# Altium schematic sheet sensor.SchDoc
size A3
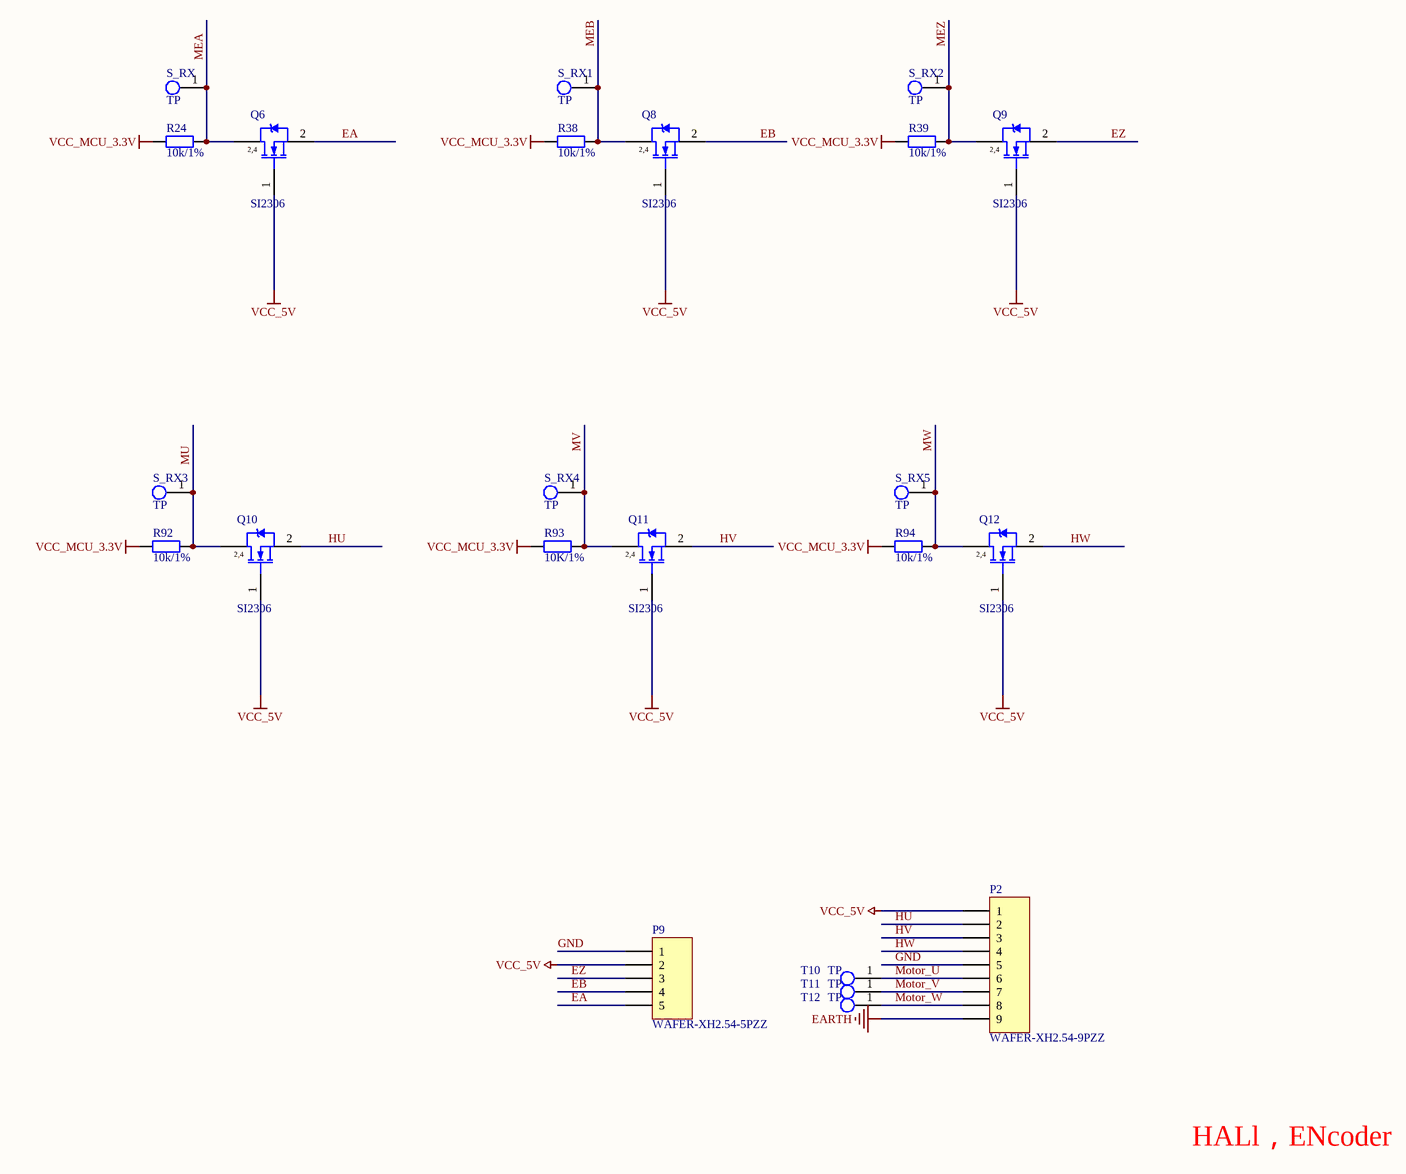
[diagram p0: sensor.SchDoc]

## Parts
P2  WAFER-XH2.54-9PZZ  [XA2.5-9P]
P9  WAFER-XH2.54-5PZZ  [XA2.5-5P]
Q6  SI2306  [SOT23-3]
Q8  SI2306  [SOT23-3]
Q9  SI2306  [SOT23-3]
Q10  SI2306  [SOT23-3]
Q11  SI2306  [SOT23-3]
Q12  SI2306  [SOT23-3]
R24  10k/1%  [0603R]
R38  10k/1%  [0603R]
R39  10k/1%  [0603R]
R92  10k/1%  [0603R]
R93  10K/1%  [0603R]
R94  10k/1%  [0603R]
S_RX  TP  [TPD]
S_RX1  TP  [TPD]
S_RX2  TP  [TPD]
S_RX3  TP  [TPD]
S_RX4  TP  [TPD]
S_RX5  TP  [TPD]
T10  TP  [TPD]
T11  TP  [TPD]
T12  TP  [TPD]

## Nets
EARTH: P2.9
VCC_5V: P2.1 P9.2 Q6.1(G) Q8.1(G) Q9.1(G) Q10.1(G) Q11.1(G) Q12.1(G)
VCC_MCU_3.3V: R24.1 R38.1 R39.1 R92.1 R93.1 R94.1
EA: P9.5 Q6.2(S)
EB: P9.4 Q8.2(S)
EZ: P9.3 Q9.2(S)
GND: P2.5 P9.1
HU: P2.2 Q10.2(S)
HV: P2.3 Q11.2(S)
HW: P2.4 Q12.2(S)
MEA: Q6.3(D) R24.2 S_RX.1
MEB: Q8.3(D) R38.2 S_RX1.1
MEZ: Q9.3(D) R39.2 S_RX2.1
Motor_U: P2.6 T10.1
Motor_V: P2.7 T11.1
Motor_W: P2.8 T12.1
MU: Q10.3(D) R92.2 S_RX3.1
MV: Q11.3(D) R93.2 S_RX4.1
MW: Q12.3(D) R94.2 S_RX5.1

## Notes on the sheet
- HALl，ENcoder
- (in symbol BUK92150-55A) 2,4

## Library data of the parts
P2 = Header 9: Header, 9-Pin; Package: XA2.5-9P
P9 = Header 5: Header, 5-Pin; Package: XA2.5-5P
Q6 Q8-Q12 = BUK92150-55A: Package: SOT23-3
R24 R38 R39 R92-R94 = Res2: Resistor; Package: 0603
S_RX S_RX1-S_RX5 T10-T12 = TP: Package: TPD